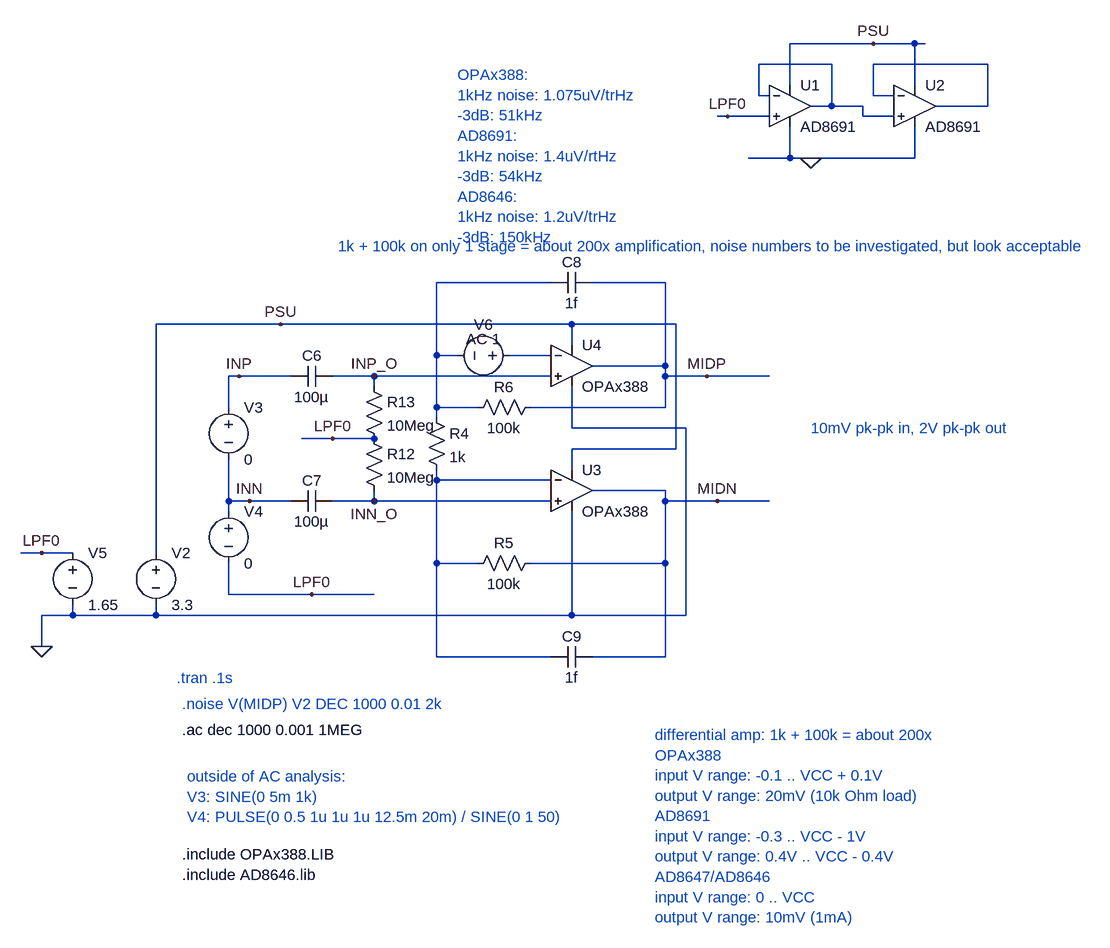
[diagram p0: schematic sinewave.asc]
sinewave.asc, the LTspice schematic file:
Version 4
SHEET 1 4412 8944
WIRE 2480 -384 2352 -384
WIRE 2544 -384 2480 -384
WIRE 2560 -384 2544 -384
WIRE 2416 -352 2304 -352
WIRE 2656 -352 2480 -352
WIRE 2352 -320 2352 -384
WIRE 2544 -320 2544 -384
WIRE 2304 -304 2304 -352
WIRE 2320 -304 2304 -304
WIRE 2480 -304 2480 -352
WIRE 2512 -304 2480 -304
WIRE 2416 -288 2416 -352
WIRE 2416 -288 2384 -288
WIRE 2464 -288 2416 -288
WIRE 2656 -288 2656 -352
WIRE 2656 -288 2576 -288
WIRE 2256 -272 2240 -272
WIRE 2320 -272 2256 -272
WIRE 2464 -272 2464 -288
WIRE 2512 -272 2464 -272
WIRE 2352 -208 2352 -256
WIRE 2352 -208 2288 -208
WIRE 2384 -208 2352 -208
WIRE 2544 -208 2544 -256
WIRE 2544 -208 2384 -208
WIRE 1984 -16 1808 -16
WIRE 2160 -16 2048 -16
WIRE 1568 48 1376 48
WIRE 2016 48 1568 48
WIRE 2176 48 2016 48
WIRE 2016 80 2016 48
WIRE 1808 96 1808 -16
WIRE 1840 96 1808 96
WIRE 1984 96 1920 96
WIRE 2160 112 2160 -16
WIRE 2160 112 2048 112
WIRE 1504 128 1488 128
WIRE 1584 128 1504 128
WIRE 1712 128 1648 128
WIRE 1984 128 1712 128
WIRE 2160 128 2160 112
WIRE 2224 128 2160 128
WIRE 2320 128 2224 128
WIRE 1712 144 1712 128
WIRE 1488 176 1488 128
WIRE 1808 176 1808 96
WIRE 1872 176 1808 176
WIRE 2160 176 2160 128
WIRE 2160 176 1952 176
WIRE 1808 192 1808 176
WIRE 2016 208 2016 144
WIRE 2192 208 2016 208
WIRE 1648 224 1600 224
WIRE 1712 224 1648 224
WIRE 2176 240 2176 48
WIRE 2176 240 2016 240
WIRE 2016 272 2016 240
WIRE 1808 288 1808 272
WIRE 1984 288 1808 288
WIRE 2160 304 2048 304
WIRE 1488 320 1488 256
WIRE 1520 320 1488 320
WIRE 1584 320 1520 320
WIRE 1712 320 1712 304
WIRE 1712 320 1648 320
WIRE 1984 320 1712 320
WIRE 2160 320 2160 304
WIRE 2240 320 2160 320
WIRE 2320 320 2240 320
WIRE 1488 336 1488 320
WIRE 1200 400 1168 400
WIRE 1248 400 1200 400
WIRE 1376 400 1376 48
WIRE 1808 416 1808 288
WIRE 1872 416 1808 416
WIRE 2160 416 2160 320
WIRE 2160 416 1952 416
WIRE 1488 464 1488 416
WIRE 1616 464 1488 464
WIRE 1712 464 1616 464
WIRE 1248 496 1248 480
WIRE 1248 496 1200 496
WIRE 1376 496 1376 480
WIRE 1376 496 1248 496
WIRE 2016 496 2016 336
WIRE 2016 496 1376 496
WIRE 2192 496 2192 208
WIRE 2192 496 2016 496
WIRE 1200 544 1200 496
WIRE 1808 560 1808 416
WIRE 1984 560 1808 560
WIRE 2160 560 2160 416
WIRE 2160 560 2048 560
FLAG 1200 544 0
FLAG 1200 400 LPF0
FLAG 1648 224 LPF0
FLAG 1568 48 PSU
FLAG 1504 128 INP
FLAG 1520 320 INN
FLAG 1616 464 LPF0
FLAG 2224 128 MIDP
FLAG 2240 320 MIDN
FLAG 1712 128 INP_O
FLAG 1712 320 INN_O
FLAG 2480 -384 PSU
FLAG 2384 -208 0
FLAG 2256 -272 LPF0
SYMBOL voltage 1376 384 R0
SYMATTR InstName V2
SYMATTR Value 3.3
SYMBOL res 1792 176 R0
SYMATTR InstName R4
SYMATTR Value 1k
SYMBOL res 1968 400 R90
WINDOW 0 0 56 VBottom 2
WINDOW 3 32 56 VTop 2
SYMATTR InstName R5
SYMATTR Value 100k
SYMBOL res 1968 160 R90
WINDOW 0 0 56 VBottom 2
WINDOW 3 32 56 VTop 2
SYMATTR InstName R6
SYMATTR Value 100k
SYMBOL voltage 1488 160 R0
WINDOW 123 24 118 Left 2
SYMATTR InstName V3
SYMATTR Value 0
SYMBOL voltage 1488 320 R0
WINDOW 123 24 118 Left 2
SYMATTR InstName V4
SYMATTR Value 0
SYMBOL voltage 1248 384 R0
SYMATTR InstName V5
SYMATTR Value 1.65
SYMBOL cap 1648 112 R90
WINDOW 0 0 32 VBottom 2
WINDOW 3 32 32 VTop 2
SYMATTR InstName C6
SYMATTR Value 100µ
SYMBOL cap 1648 304 R90
WINDOW 0 0 32 VBottom 2
WINDOW 3 32 32 VTop 2
SYMATTR InstName C7
SYMATTR Value 100µ
SYMBOL res 1696 208 R0
SYMATTR InstName R12
SYMATTR Value 10Meg
SYMBOL res 1696 128 R0
SYMATTR InstName R13
SYMATTR Value 10Meg
SYMBOL cap 2048 -32 R90
WINDOW 0 0 32 VBottom 2
WINDOW 3 32 32 VTop 2
SYMATTR InstName C8
SYMATTR Value 1f
SYMBOL cap 2048 544 R90
WINDOW 0 0 32 VBottom 2
WINDOW 3 32 32 VTop 2
SYMATTR InstName C9
SYMATTR Value 1f
SYMBOL voltage 1936 96 R90
WINDOW 0 -32 56 VBottom 2
WINDOW 3 32 56 VTop 2
WINDOW 123 -10 56 VBottom 2
SYMATTR InstName V6
SYMATTR Value ""
SYMATTR Value2 AC 1
SYMBOL OpAmps/AD8691 2352 -352 R0
SYMATTR InstName U1
SYMBOL OpAmps/AD8691 2544 -352 R0
SYMATTR InstName U2
SYMBOL OpAmps/opamp2 2016 240 R0
SYMATTR InstName U3
SYMATTR Value OPAx388
SYMBOL OpAmps/opamp2 2016 48 R0
SYMATTR InstName U4
SYMATTR Value OPAx388
TEXT 1408 592 Left 2 ;.tran .1s
TEXT 1416 632 Left 2 ;.noise V(MIDP) V2 DEC 1000 0.01 2k
TEXT 1424 744 Left 2 ;outside of AC analysis: \nV3: SINE(0 5m 1k)\nV4: PULSE(0 0.5 1u 1u 1u 12.5m 20m) / SINE(0 1 50)
TEXT 1416 672 Left 2 !.ac dec 1000 0.001 1MEG
TEXT 1656 -72 Left 2 ;1k + 100k on only 1 stage = about 200x amplification, noise numbers to be investigated, but look acceptable
TEXT 2144 680 Left 2 ;differential amp: 1k + 100k = about 200x\nOPAx388\ninput V range: -0.1 .. VCC + 0.1V\noutput V range: 20mV (10k Ohm load)\nAD8691\ninput V range: -0.3 .. VCC - 1V\noutput V range: 0.4V .. VCC - 0.4V\nAD8647/AD8646\ninput V range: 0 .. VCC\noutput V range: 10mV (1mA)
TEXT 1840 -336 Left 2 ;OPAx388: \n1kHz noise: 1.075uV/trHz\n-3dB: 51kHz\nAD8691: \n1kHz noise: 1.4uV/rtHz\n-3dB: 54kHz\nAD8646: \n1kHz noise: 1.2uV/trHz\n-3dB: 150kHz
TEXT 1416 864 Left 2 !.include OPAx388.LIB\n.include AD8646.lib
TEXT 2384 208 Left 2 ;10mV pk-pk in, 2V pk-pk out

The netlist it stands for:
* sinewave.asc
V2 PSU 0 3.3
R4 N003 N005 1k
R5 MIDN N005 100k
R6 MIDP N003 100k
V3 INP INN 0
V4 INN LPF0 0
V5 LPF0 0 1.65
C6 INP_O INP 100µ
C7 INN_O INN 100µ
R12 LPF0 INN_O 10Meg
R13 INP_O LPF0 10Meg
C8 MIDP N003 1f
C9 MIDN N005 1f
V6 N004 N003 AC 1
XU1 LPF0 N001 PSU 0 N001 AD8691  ; pins In+ In- V+ V- OUT
XU2 N001 N002 PSU 0 N002 AD8691  ; pins In+ In- V+ V- OUT
XU3 INN_O N005 PSU 0 MIDN OPAx388  ; pins In+ In- V+ V- OUT
XU4 INP_O N004 PSU 0 MIDP OPAx388  ; pins In+ In- V+ V- OUT
* .tran .1s
* .noise V(MIDP) V2 DEC 1000 0.01 2k
* outside of AC analysis:
* V3: SINE(0 5m 1k)
* V4: PULSE(0 0.5 1u 1u 1u 12.5m 20m) / SINE(0 1 50)
.ac dec 1000 0.001 1MEG
* 1k + 100k on only 1 stage = about 200x amplification, noise numbers to be investigated, but look acceptable
* differential amp: 1k + 100k = about 200x
* OPAx388
* input V range: -0.1 .. VCC + 0.1V
* output V range: 20mV (10k Ohm load)
* AD8691
* input V range: -0.3 .. VCC - 1V
* output V range: 0.4V .. VCC - 0.4V
* AD8647/AD8646
* input V range: 0 .. VCC
* output V range: 10mV (1mA)
* OPAx388:
* 1kHz noise: 1.075uV/trHz
* -3dB: 51kHz
* AD8691:
* 1kHz noise: 1.4uV/rtHz
* -3dB: 54kHz
* AD8646:
* 1kHz noise: 1.2uV/trHz
* -3dB: 150kHz
.include OPAx388.LIB
.include AD8646.lib
* 10mV pk-pk in, 2V pk-pk out
.backanno
.end